# EAGLE design pi_zero_drone_controller_hat (EAGLE 8.5.2)

## Sheet 1 of 2
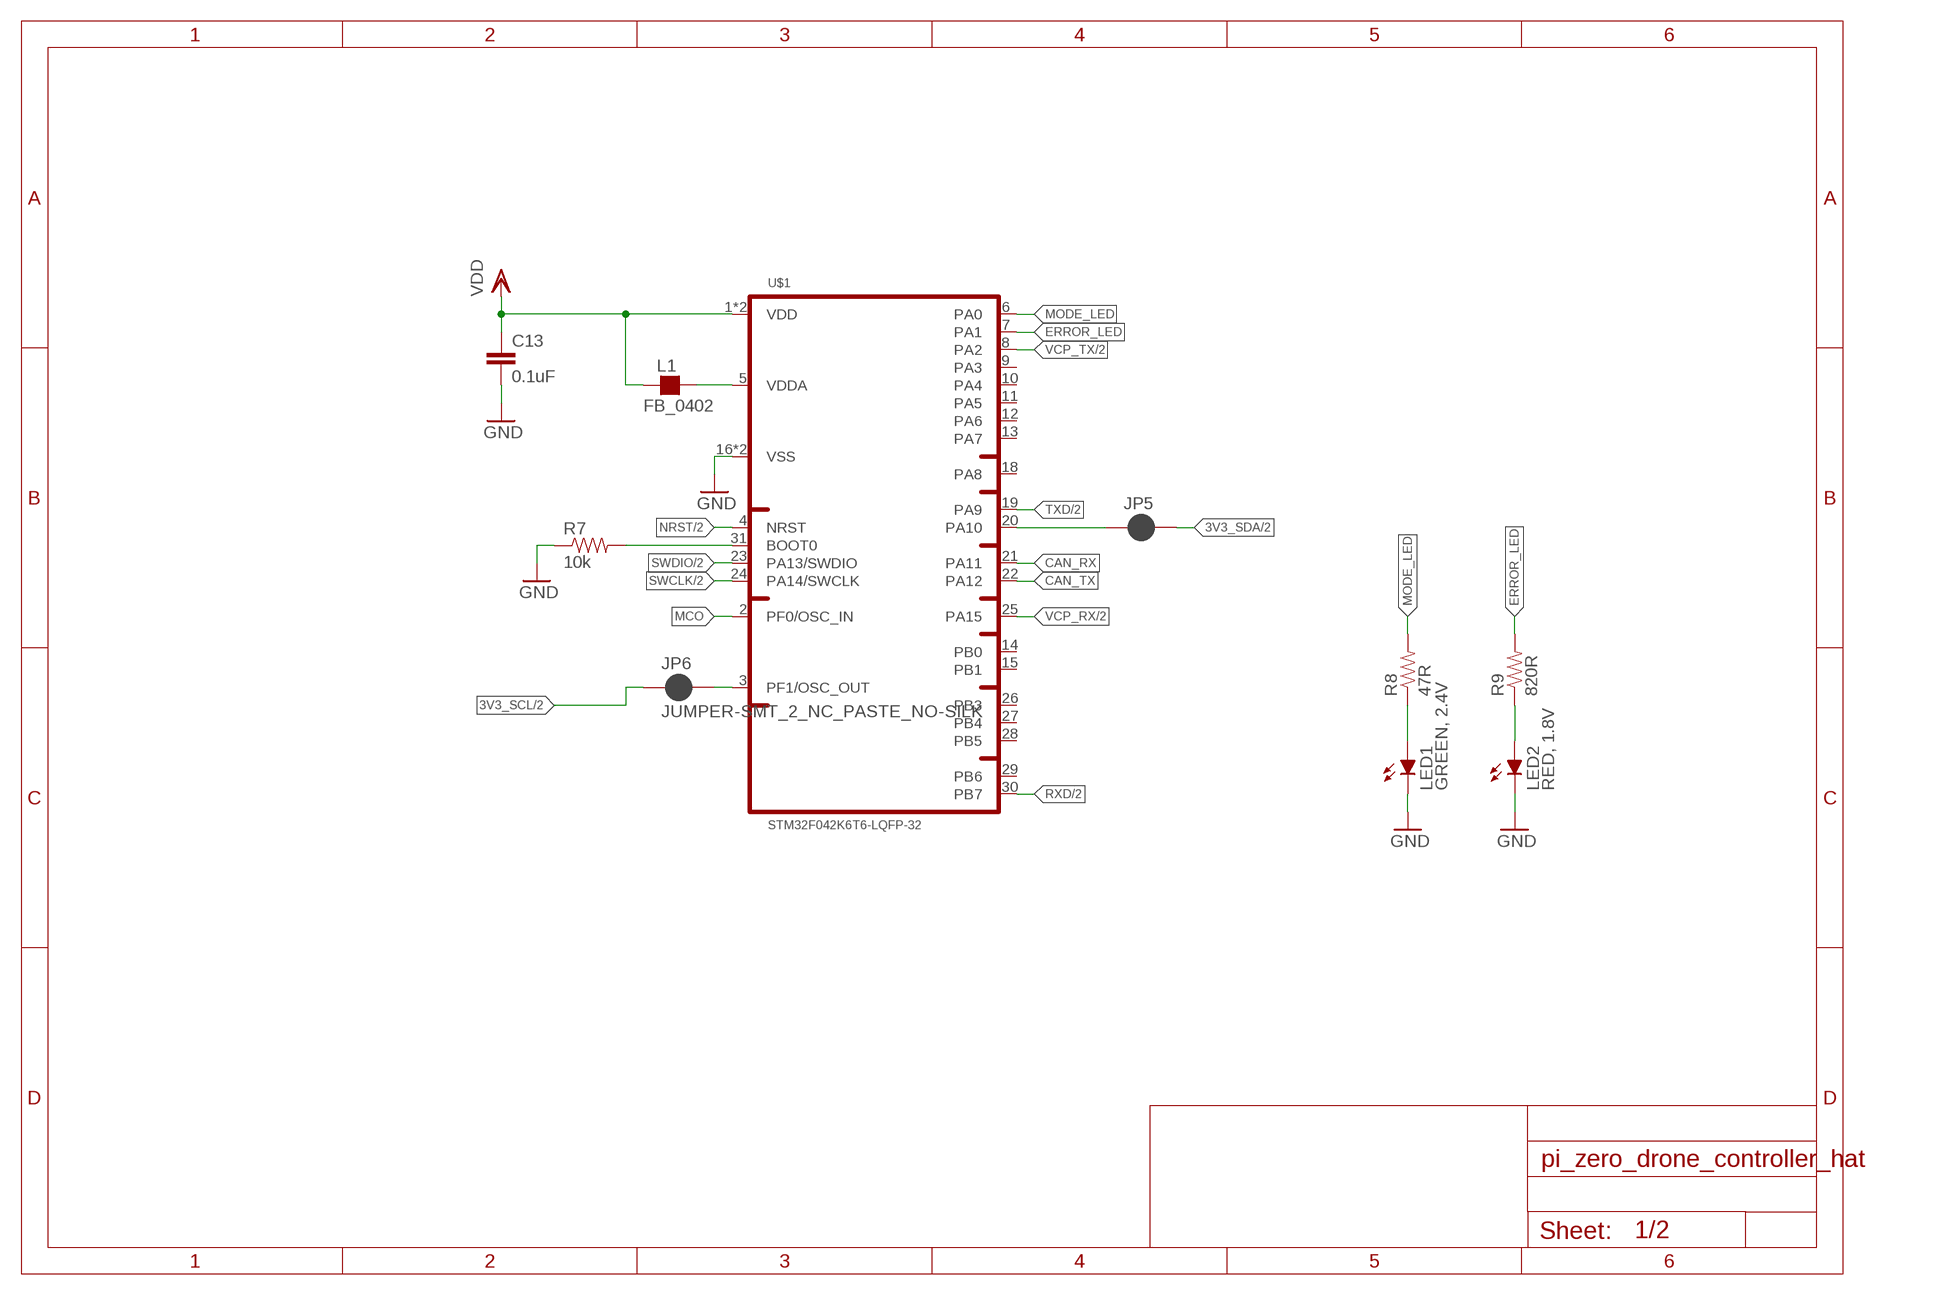
[diagram p0: schematic, sheet 1]

### Parts
C13  0.1uF  0.1UF-0402-16V-10%  [0402]
JP5  JUMPER-SMT_2_NC_PASTE_NO-SILK  [SMT-JUMPER_2_NC_PASTE_NO-SILK]
JP6  JUMPER-SMT_2_NC_PASTE_NO-SILK  [SMT-JUMPER_2_NC_PASTE_NO-SILK]
L1  FB_0402  [L0402]
LED1  GREEN, 2.4V  LEDCHIP-LED0603  [CHIP-LED0603]
LED2  RED, 1.8V  LEDCHIP-LED0603  [CHIP-LED0603]
R7  10k  SPARKFUN-RESISTORS_RESISTOR  [RES_0402]
R8  47R  SPARKFUN-RESISTORS_RESISTOR  [RES_0402]
R9  820R  SPARKFUN-RESISTORS_RESISTOR  [RES_0402]
U$1  STM32F042K6T6-LQFP-32  [LQFP-32]

### Nets
3V3_SCL: JP6.1 ; also sheet 2
3V3_SDA: JP5.2 ; also sheet 2
CAN_RX: U$1.21(PA11)
CAN_TX: U$1.22(PA12)
ERROR_LED: R9.2 U$1.7(PA1)
GND: C13.2 LED1.C LED2.C R7.1 U$1.16(VSS) U$1.32(VSS) ; also sheet 2
MCO: U$1.2(PF0/OSC_IN)
MODE_LED: R8.2 U$1.6(PA0)
N$7: R7.2 U$1.31(BOOT0)
N$9: L1.2 U$1.5(VDDA)
N$10: JP5.1 U$1.20(PA10)
N$12: JP6.2 U$1.3(PF1/OSC_OUT)
N$14: LED2.A R9.1
N$15: LED1.A R8.1
NRST: U$1.4(NRST) ; also sheet 2
RXD: U$1.30(PB7) ; also sheet 2
SWCLK: U$1.24(PA14/SWCLK) ; also sheet 2
SWDIO: U$1.23(PA13/SWDIO) ; also sheet 2
TXD: U$1.19(PA9) ; also sheet 2
VCP_RX: U$1.25(PA15) ; also sheet 2
VCP_TX: U$1.8(PA2) ; also sheet 2
VDD: C13.1 L1.1 U$1.1(VDD) U$1.17(VDD) ; also sheet 2
Unconnected: U$1.9(PA3) U$1.10(PA4) U$1.11(PA5) U$1.12(PA6) U$1.13(PA7) U$1.14(PB0) U$1.15(PB1) U$1.18(PA8) U$1.26(PB3) U$1.27(PB4) U$1.28(PB5) U$1.29(PB6)

## Sheet 2 of 2
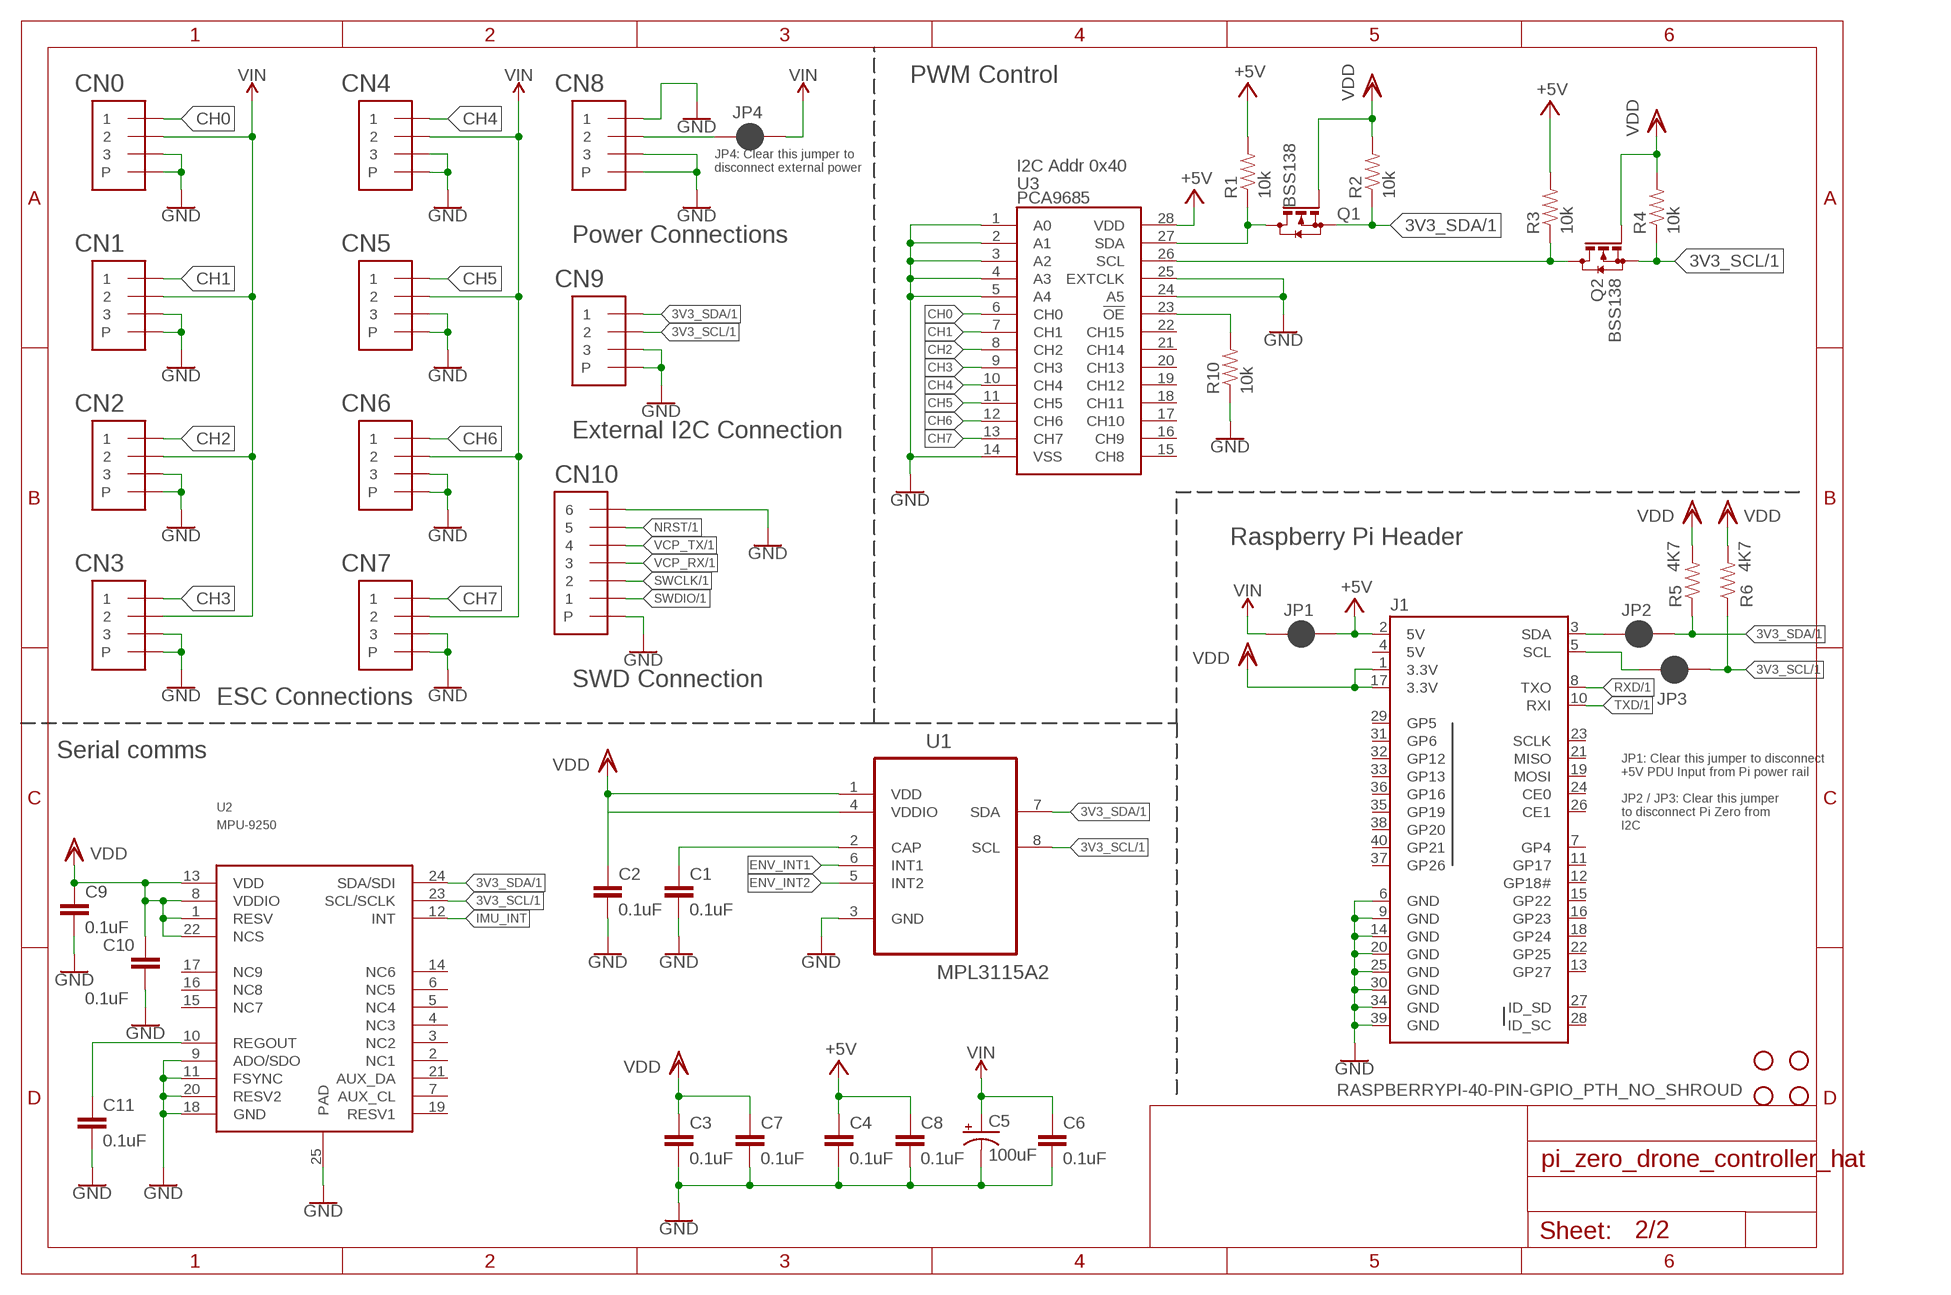
[diagram p1: schematic, sheet 2]

### Parts
C1  0.1uF  0.1UF-0402-16V-10%  [0402]
C2  0.1uF  0.1UF-0402-16V-10%  [0402]
C3  0.1uF  0.1UF-0402-16V-10%  [0402]
C4  0.1uF  0.1UF-0402-16V-10%  [0402]
C5  100uF  100UF-POLAR-25V-20%(ELEC)  [PANASONIC_D]
C6  0.1uF  0.1UF-0402-16V-10%  [0402]
C7  0.1uF  0.1UF-0402-16V-10%  [0402]
C8  0.1uF  0.1UF-0402-16V-10%  [0402]
C9  0.1uF  0.1UF-0402-16V-10%  [0402]
C10  0.1uF  0.1UF-0402-16V-10%  [0402]
C11  0.1uF  0.1UF-0402-16V-10%  [0402]
CN0  JST_SH_3  [JST_SH_3]
CN1  JST_SH_3  [JST_SH_3]
CN2  JST_SH_3  [JST_SH_3]
CN3  JST_SH_3  [JST_SH_3]
CN4  JST_SH_3  [JST_SH_3]
CN5  JST_SH_3  [JST_SH_3]
CN6  JST_SH_3  [JST_SH_3]
CN7  JST_SH_3  [JST_SH_3]
CN8  JST_SH_3  [JST_SH_3]
CN9  JST_SH_3  [JST_SH_3]
CN10  JST_SH_6  [JST_SH_6]
H1  STAND-OFF  [STAND-OFF]
H2  STAND-OFF  [STAND-OFF]
H3  STAND-OFF  [STAND-OFF]
H4  STAND-OFF  [STAND-OFF]
J1  RASPBERRYPI-40-PIN-GPIO_PTH_NO_SHROUD  [2X20]
JP1  JUMPER-SMT_2_NC_PASTE_NO-SILK  [SMT-JUMPER_2_NC_PASTE_NO-SILK]
JP2  JUMPER-SMT_2_NC_PASTE_NO-SILK  [SMT-JUMPER_2_NC_PASTE_NO-SILK]
JP3  JUMPER-SMT_2_NC_PASTE_NO-SILK  [SMT-JUMPER_2_NC_PASTE_NO-SILK]
JP4  JUMPER-SMT_2_NC_PASTE_NO-SILK  [SMT-JUMPER_2_NC_PASTE_NO-SILK]
Q1  BSS138  [SOT23]
Q2  BSS138  [SOT23]
R1  10k  SPARKFUN-RESISTORS_RESISTOR  [RES_0402]
R2  10k  SPARKFUN-RESISTORS_RESISTOR  [RES_0402]
R3  10k  SPARKFUN-RESISTORS_RESISTOR  [RES_0402]
R4  10k  SPARKFUN-RESISTORS_RESISTOR  [RES_0402]
R5  4K7  SPARKFUN-RESISTORS_RESISTOR  [RES_0402]
R6  4K7  SPARKFUN-RESISTORS_RESISTOR  [RES_0402]
R10  10k  SPARKFUN-RESISTORS_RESISTOR  [RES_0402]
U1  MPL3115A2  [DFN300X500X120-8N]
U2  MPU-9250  [LEAD-QFN24]
U3  PCA9685  [TSSOP-28_4MM]

### Nets
3V3_SCL: CN9.2 JP3.2 Q2.2(S) R4.1 R6.1 U1.8(SCL) U2.23(SCL/SCLK) ; also sheet 1
3V3_SDA: CN9.1 JP2.2 Q1.2(S) R2.1 R5.1 U1.7(SDA) U2.24(SDA/SDI) ; also sheet 1
+5V: C4.1 C8.1 J1.2(5V) JP1.2 R1.2 R3.2 U3.28(VDD)
CH0: CN0.1 U3.6(CH0)
CH1: CN1.1 U3.7(CH1)
CH2: CN2.1 U3.8(CH2)
CH3: CN3.1 U3.9(CH3)
CH4: CN4.1 U3.10(CH4)
CH5: CN5.1 U3.11(CH5)
CH6: CN6.1 U3.12(CH6)
CH7: CN7.1 U3.13(CH7)
ENV_INT1: U1.6(INT1)
ENV_INT2: U1.5(INT2)
GND: C1.2 C2.2 C3.2 C4.2 C5.- C6.2 C7.2 C8.2 C9.2 C10.2 C11.2 CN0.3 CN0.P$1(P) CN0.P$2(P) CN1.3 CN1.P$1(P) CN1.P$2(P) CN2.3 CN2.P$1(P) CN2.P$2(P) CN3.3 CN3.P$1(P) CN3.P$2(P) CN4.3 CN4.P$1(P) CN4.P$2(P) CN5.3 CN5.P$1(P) CN5.P$2(P) CN6.3 CN6.P$1(P) CN6.P$2(P) CN7.3 CN7.P$1(P) CN7.P$2(P) CN8.1 CN8.3 CN8.P$1(P) CN8.P$2(P) CN9.3 CN9.P$1(P) CN9.P$2(P) CN10.6 CN10.P$1(P) CN10.P$2(P) J1.6(GND) J1.9(GND) J1.14(GND) J1.20(GND) J1.25(GND) J1.30(GND) J1.34(GND) J1.39(GND) R10.1 U1.3(GND) U2.9(ADO/SDO) U2.11(FSYNC) U2.18(GND) U2.20(RESV2) U2.25(PAD) U3.1(A0) U3.2(A1) U3.3(A2) U3.4(A3) U3.5(A4) U3.14(VSS) U3.24(A5) U3.25(EXTCLK) ; also sheet 1
IMU_INT: U2.12(INT)
N$1: Q1.3(D) R1.1 U3.27(SDA)
N$2: Q2.3(D) R3.1 U3.26(SCL)
N$3: C11.1 U2.10(REGOUT)
N$4: J1.5(SCL) JP3.1
N$5: J1.3(SDA) JP2.1
N$6: C1.1 U1.2(CAP)
N$8: CN8.2 JP4.1
N$11: R10.2 U3.23(!OE)
NRST: CN10.5 ; also sheet 1
RXD: J1.8(TXO) ; also sheet 1
SWCLK: CN10.2 ; also sheet 1
SWDIO: CN10.1 ; also sheet 1
TXD: J1.10(RXI) ; also sheet 1
VCP_RX: CN10.3 ; also sheet 1
VCP_TX: CN10.4 ; also sheet 1
VDD: C2.1 C3.1 C7.1 C9.1 C10.1 J1.1(3.3V) J1.17(3.3V) Q1.1(G) Q2.1(G) R2.2 R4.2 R5.2 R6.2 U1.1(VDD) U1.4(VDDIO) U2.1(RESV) U2.8(VDDIO) U2.13(VDD) U2.22(NCS) ; also sheet 1
VIN: C5.+ C6.1 CN0.2 CN1.2 CN2.2 CN3.2 CN4.2 CN5.2 CN6.2 CN7.2 JP1.1 JP4.2
Unconnected: J1.7(GP4) J1.11(GP17) J1.12(GP18#) J1.13(GP27) J1.15(GP22) J1.16(GP23) J1.18(GP24) J1.19(MOSI) J1.21(MISO) J1.22(GP25) J1.23(SCLK) J1.24(CE0) J1.26(CE1) J1.27(ID_SD) J1.28(ID_SC) J1.29(GP5) J1.31(GP6) J1.32(GP12) J1.33(GP13) J1.35(GP19) J1.36(GP16) J1.37(GP26) J1.38(GP20) J1.40(GP21) U2.2(NC1) U2.3(NC2) U2.4(NC3) U2.5(NC4) U2.6(NC5) U2.7(AUX_CL) U2.14(NC6) U2.15(NC7) U2.16(NC8) U2.17(NC9) U2.19(RESV1) U2.21(AUX_DA) U3.15(CH8) U3.16(CH9) U3.17(CH10) U3.18(CH11) U3.19(CH12) U3.20(CH13) U3.21(CH14) U3.22(CH15)

### Notes on the sheet
- PWM Control
- JP4: Clear this jumper to 
  disconnect external power
- I2C Addr 0x40
- Power Connections
- External I2C Connection
- Raspberry Pi Header
- SWD Connection
- ESC Connections
- Serial comms
- JP1: Clear this jumper to disconnect 
  +5V PDU Input from Pi power rail
  
  JP2 / JP3: Clear this jumper
  to disconnect Pi Zero from
  I2C

## Power pins joined to a net without a drawn wire
5V: J1.4(5V)

## Library data of the parts
C1-C4 C6-C11 C13 = SparkFun-Capacitors:0.1UF: 0.1µF ceramic capacitors A capacitor is a passive two-terminal electrical component used to store electrical energy temporarily in an electric field.; PROD_ID: CAP-12416
C5 = SparkFun-Capacitors:100UF-POLAR: 100µF polarized capacitors A capacitor is a passive two-terminal electrical component used to store electrical energy temporarily in an electric field.; PROD_ID: CAP-12547
CN0 CN1-CN9 = asg_motor_driver_copy:JST_SH_3
CN10 = asg_motor_driver_copy:JST_SH_6
H1-H4 = SparkFun-Hardware:STAND-OFF: Stand Off Drill holes for mechanically mounting via screws, standoffs, etc. Note: Use the keepout ring to avoid running the screw head into surrounding components. Variant Overviews STAND-OFF - Mechanical footprint for a #4 phillips button head screw. STAND-OFF-TIGHT - Mechanical footprint for a #4 phillips button head screw, Example SparkFun Products Screw - Phillips Head (1/4", 4-40, 10 pack) <https://www.sparkfun.com/products/10453> (PRT-10453) Screw - Phillips Head (1/2", 4-40, 10 pack) <https://www.sparkfun.com/products/10452> (PRT-10452) Screw - Phillips Head (3/4", 4-40, 10 pack) <https://www.sparkfun.com/products/10451> (PRT-10451) Screw - Phillips Head (1", 4-40, 10 pack) <https://www.sparkfun.com/products/10450> (PRT-10450)
J1 = SparkFun-Connectors:RASPBERRYPI-40-PIN-GPIO: Raspberry Pi GPIO Header 2x20 pin connector, as found on B, B+, A+ models. Both shrouded PTH and SMT versions available. SparkFun Products: GPIO Shrouded Header <https://www.sparkfun.com/products/13054>- PTH SparkFun Pi Wedge (Preassembled) <https://www.sparkfun.com/products/13717>
JP1-JP6 = SparkFun-Jumpers:JUMPER-SMT_2_NC_PASTE: Normally closed solder jumper This jumper has an aperture in the stencil to allow solder paste to bridge the split in the wire so it's normally closed (NC). Wick off the solder to open the connection. Reapply solder to reclose the connection.
L1 = asg_motor_driver_copy:FB_: FERRITE BEAD
LED1 LED2 = asg_motor_driver_copy:LED: LED Various Types
Q1 Q2 = asg_motor_driver_copy:BSS138: N-CHANNEL MOS FET
R1-R10 = asg_motor_driver_copy:SPARKFUN-RESISTORS_RESISTOR: Resistor Basic schematic elements and footprints for 0603, 1206, and PTH resistors.
U1 = MPL3115A2:MPL3115A2: PRESSURE SENSOR, 20-110KPA, 8LGA; MPN: MPL3115A2; OC_FARNELL: 2009084; OC_NEWARK: 48T4344; PACKAGE: 8LGA; SUPPLIER: FREESCALE SEMICONDUCTOR
U2 = invensense:MPU-9250
U3 = SparkFun-IC-Special-Function:PCA9685: 16-channel 12-bit PWM I2C interface Internal Oscillator 40Hz to 1kHz Can be totem pole or open collector 2.3V to 5.5V SparkFun Products SparkFun Block for Intel® Edison - PWM <https://www.sparkfun.com/products/13042> (DEV-13042) PROTO: IC-12240 PROD_ID: IC-12271; PROD_ID: IC-12271
U$1 = STM32F042K6T6:STM32F042K6T6

## Board
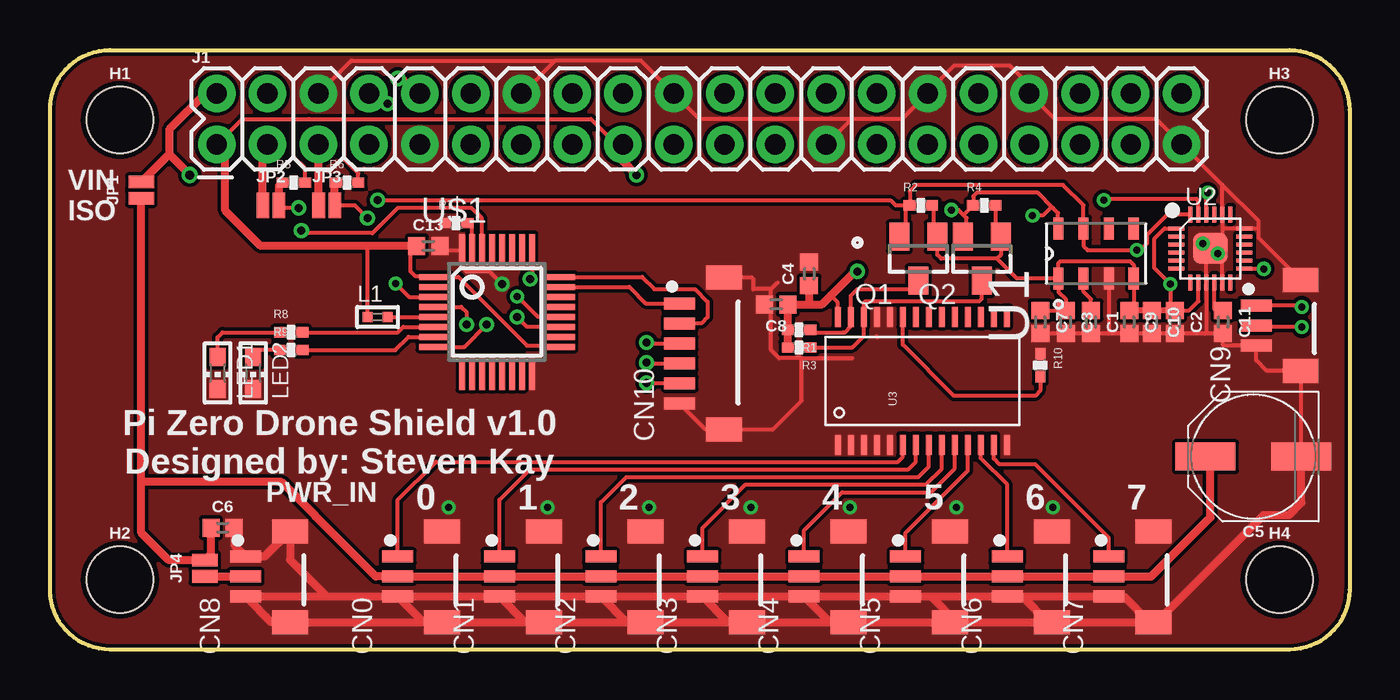
[diagram p2: board, top side]
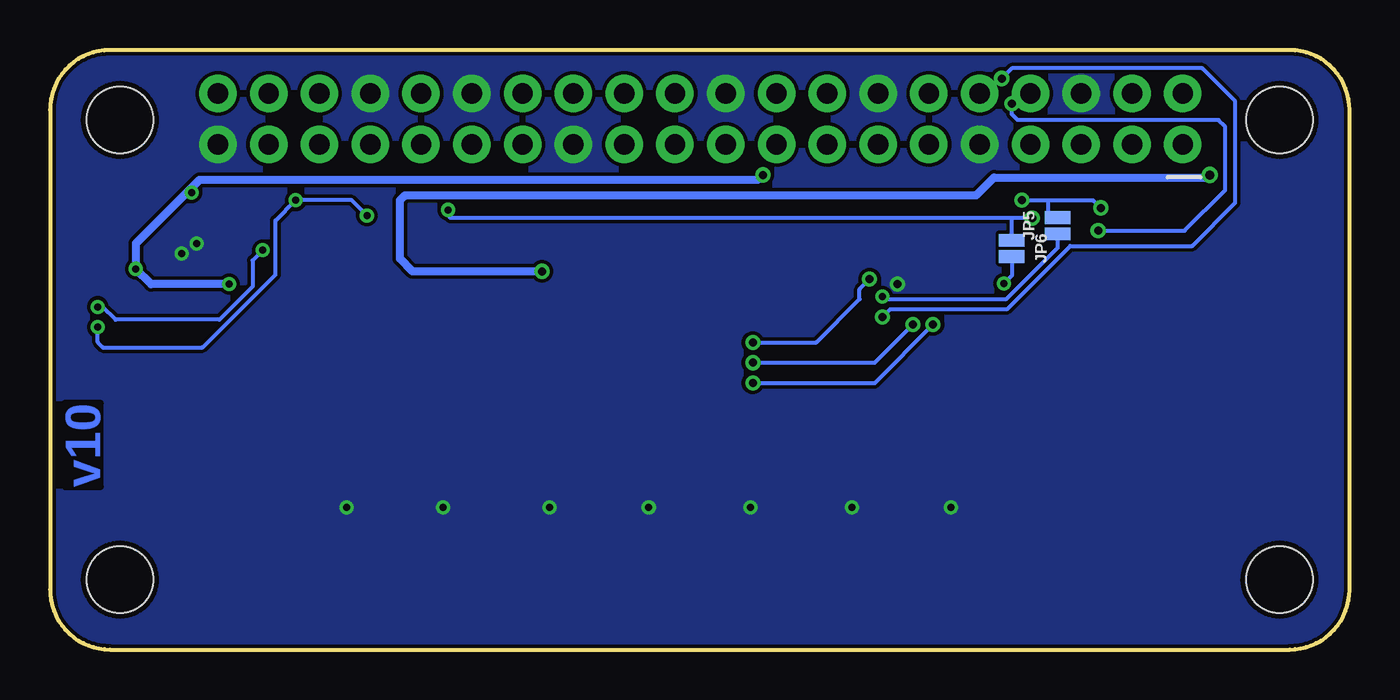
[diagram p3: board, bottom side, seen from below]

Size 65 x 30 mm. Coordinates in mm from the lower left corner, seen from the top.
Outline: 62,0 3,0 arc-90 0,3 0,27 arc-90 3,30 62,30 arc-90 65,27 65,3 arc-90 62,0
Copper layers (1*16): Top 0.035mm / dielectric 1.5mm / Bottom 0.035mm
Design rules "SparkFun-2-layer-TIGHT": minimum track width 7mil, minimum drill 15mil, track to track 7mil, track to pad 7mil, pad to pad 7mil, via to via 7mil, smd to smd 7mil, copper to edge 7mil, drill to drill 7mil, minimum pad ring 7mil, minimum via ring 7mil, stop-mask expansion 4mil, vias tented up to drill 25mil, thermal gap 10mil

### Footprints (pad centres in the part's own frame; a part is rotated, then mirrored left to right if it is on the bottom)
0402 = smd 0.85 x 0.9: 1 -0.58,0; 2 0.58,0
PANASONIC_D = smd 3 x 1.4: + 2.4,0; - -2.4,0
JST_SH_3 = smd 0.6 x 1.55: 1 0.46,1.27; 2 -0.54,1.27; 3 -1.54,1.27 | smd 1.2 x 1.8: P$1 -2.824,-0.955; P$2 1.728,-0.955
JST_SH_6 = smd 0.6 x 1.55: 1 5,0; 2 4,0; 3 3,0; 4 2,0; 5 1,0; 6 0,0 | smd 1.2 x 1.8: P$1 -1.3,-2.225; P$2 6.3,-2.225
STAND-OFF = hole 3.302: 0,0
2X20 = drill 1.016 pad 1.88: 1 0,0; 2 0,2.54; 3 2.54,0; 4 2.54,2.54; 5 5.08,0; 6 5.08,2.54; 7 7.62,0; 8 7.62,2.54; 9 10.16,0; 10 10.16,2.54; 11 12.7,0; 12 12.7,2.54; 13 15.24,0; 14 15.24,2.54; 15 17.78,0; 16 17.78,2.54; 17 20.32,0; 18 20.32,2.54; 19 22.86,0; 20 22.86,2.54; 21 25.4,0; 22 25.4,2.54; 23 27.94,0; 24 27.94,2.54; 25 30.48,0; 26 30.48,2.54; 27 33.02,0; 28 33.02,2.54; 29 35.56,0; 30 35.56,2.54; 31 38.1,0; 32 38.1,2.54; 33 40.64,0; 34 40.64,2.54; 35 43.18,0; 36 43.18,2.54; 37 45.72,0; 38 45.72,2.54; 39 48.26,0; 40 48.26,2.54
SMT-JUMPER_2_NC_PASTE_NO-SILK = smd 0.635 x 1.27: 1 -0.406,0; 2 0.406,0
L0402 = smd 0.5 x 0.5: 1 -0.508,0; 2 0.508,0
CHIP-LED0603 = smd 0.8 x 0.9: A 0,-0.794; C 0,0.794
SOT23 = smd 1 x 1.4: 1 -0.95,-1.1; 2 0.95,-1.1; 3 0,1.1
RES_0402 = smd 0.61 x 0.508: 1 -0.559,0; 2 0.559,0
DFN300X500X120-8N = smd 1.092 x 0.508: 1 -1.245,1.88; 2 -1.245,0.635; 3 -1.245,-0.635; 4 -1.245,-1.88; 5 1.245,-1.88; 6 1.245,-0.635; 7 1.245,0.635; 8 1.245,1.88
LEAD-QFN24 = smd 0.8 x 0.2: 1 -1.7,1; 2 -1.7,0.6; 3 -1.7,0.2; 4 -1.7,-0.2; 5 -1.7,-0.6; 6 -1.7,-1; 13 1.7,-1; 14 1.7,-0.6; 15 1.7,-0.2; 16 1.7,0.2; 17 1.7,0.6; 18 1.7,1 | smd 0.2 x 0.8: 7 -1,-1.7; 8 -0.6,-1.7; 9 -0.2,-1.7; 10 0.2,-1.7; 11 0.6,-1.7; 12 1,-1.7; 19 1,1.7; 20 0.6,1.7; 21 0.2,1.7; 22 -0.2,1.7; 23 -0.6,1.7; 24 -1,1.7 | smd 1.7 x 1.54: 25 0,0
TSSOP-28_4MM = smd 1 x 0.3: 1 -3.2,4.225; 2 -3.2,3.575; 3 -3.2,2.925; 4 -3.2,2.275; 5 -3.2,1.625; 6 -3.2,0.975; 7 -3.2,0.325; 8 -3.2,-0.325; 9 -3.2,-0.975; 10 -3.2,-1.625; 11 -3.2,-2.275; 12 -3.2,-2.925; 13 -3.2,-3.575; 14 -3.2,-4.225; 15 3.2,-4.225; 16 3.2,-3.575; 17 3.2,-2.925; 18 3.2,-2.275; 19 3.2,-1.625; 20 3.2,-0.975; 21 3.2,-0.325; 22 3.2,0.325; 23 3.2,0.975; 24 3.2,1.625; 25 3.2,2.275; 26 3.2,2.925; 27 3.2,3.575; 28 3.2,4.225
LQFP-32 = smd 0.3 x 1.6: 1 -1.75,-3.1; 2 -1.25,-3.1; 3 -0.75,-3.1; 4 -0.25,-3.1; 5 0.25,-3.1; 6 0.75,-3.1; 7 1.25,-3.1; 8 1.75,-3.1; 17 1.75,3.1; 18 1.25,3.1; 19 0.75,3.1; 20 0.25,3.1; 21 -0.25,3.1; 22 -0.75,3.1; 23 -1.25,3.1; 24 -1.75,3.1 | smd 1.6 x 0.3: 9 3.1,-1.75; 10 3.1,-1.25; 11 3.1,-0.75; 12 3.1,-0.25; 13 3.1,0.25; 14 3.1,0.75; 15 3.1,1.25; 16 3.1,1.75; 25 -3.1,1.75; 26 -3.1,1.25; 27 -3.1,0.75; 28 -3.1,0.25; 29 -3.1,-0.25; 30 -3.1,-0.75; 31 -3.1,-1.25; 32 -3.1,-1.75

### Placement (x,y rotation side)
C1  52.07,16.38 270 top
C2  56.26,16.38 270 top
C3  50.8,16.38 270 top
C4  37.97,18.8 90 top
C5  60.2,9.65 180 top
C6  8.64,6.1 0 top
C7  49.53,16.38 270 top
C8  36.32,17.27 180 top
C9  53.98,16.38 270 top
C10  55.12,16.38 270 top
C11  58.67,16.38 270 top
C13  18.92,20.19 0 top
CN0  18.67,4.19 90 top
CN1  23.75,4.19 90 top
CN2  28.83,4.19 90 top
CN3  33.91,4.19 90 top
CN4  38.99,4.19 90 top
CN5  44.07,4.19 90 top
CN6  49.15,4.19 90 top
CN7  54.23,4.19 90 top
CN8  11.05,4.19 90 top
CN9  61.59,16.76 90 top
CN10  31.5,12.32 90 top
H1  3.5,26.5 0 top
H2  3.5,3.5 0 top
H3  61.5,26.5 0 top
H4  61.5,3.5 0 top
J1  8.34,25.28 0 top
JP1  4.57,22.99 90 top
JP2  11.05,22.23 0 top
JP3  13.84,22.23 0 top
JP4  7.75,4.06 90 top
JP5  14.61,21.21 90 bottom
JP6  16.89,20.07 270 bottom
L1  16.38,16.64 0 top
LED1  8.38,13.84 180 top
LED2  10.16,13.84 180 top
Q1  43.43,19.56 180 top
Q2  46.61,19.56 180 top
R1  37.47,16 180 top
R2  43.56,22.23 0 top
R3  37.47,15.11 180 top
R4  46.74,22.23 0 top
R5  12.19,23.37 0 top
R6  14.86,23.37 0 top
R7  20.32,21.34 0 top
R8  12.06,15.88 0 top
R9  12.06,14.99 0 top
R10  49.53,14.22 270 top
U1  52.32,19.81 90 top
U2  58.04,20.07 0 top
U3  43.63,13.45 90 top
U$1  22.35,16.89 270 top

### Tracks (layer width: path | path; a pad name or v marks a point on that pad's centre or on a via)
3V3_SCL  (via drill 0.35, 0.4)
  Top 0.203: v62.61,16.13 60.42,16.13 CN9.2 | U1.8 50.42,21.08 50.42,21.84 50.16,22.1 | 50.16,22.1 50.04,22.1 49.66,21.72 v49.15,21.72 | U2.23 57.44,22.44 57.34,22.54 52.77,22.54 v52.7,22.48 | 50.16,22.1 49.4,22.86 46.35,22.86 46.18,22.68 R4.1 45.72,21.77 45.72,21.72 | 45.72,21.72 45.85,21.59 45.85,20.85 Q2.2 | 45.72,21.72 45.44,22 v45.09,22 | JP3.2 15.24,22.23 v15.87,21.6 v15.88,21.6
  Top 0.406: JP3.2 14.25,23.32 R6.1
  Bottom 0.203: v15.88,21.6 16.89,21.6 | 16.89,21.6 44.96,21.6 45.09,21.72 v45.09,22 | v62.61,16.13 62.61,15.37 62.36,15.11 57.37,15.11 53.72,18.76 53.72,20.95 53.72,21.46 v52.7,22.48 49.91,22.48 v49.15,21.72 | JP6.1 16.89,21.6
3V3_SDA  (via drill 0.35, 0.4)
  Top 0.203: U2.24 55.9,21.77 54.86,20.73 54.86,20.32 54.61,20.07 54.44,20.07 v54.36,19.98 51.9,19.98 51.69,20.19 U1.7 | 51.69,20.7 U1.7 | v62.61,17.14 62.53,17.22 CN9.1 | v12.45,22.1 11.58,22.1 JP2.2 | U1.7 51.69,22.23 50.67,23.24 43.31,23.24 43,22.94 R2.1 | R2.1 42.8,22.02 42.8,20.97 Q1.2 | R2.1 42.29,22.23 42.04,22.48 v16.38,22.48
  Top 0.406: 11.46,23.16 JP2.2 11.46,23.19 R5.1
  Bottom 0.203: v54.36,19.98 54.86,19.47 54.86,18.16 56.52,16.51 61.72,16.51 62.36,17.14 v62.61,17.14 | v16.38,22.48 15.11,22.48 | 15.11,22.48 12.83,22.48 v12.45,22.1 | JP5.2 15.09,21.61 | 15.09,21.61 15.11,21.59 15.12,21.59 | 15.11,22.48 15.09,22.45 15.09,21.61
+5V  (via drill 0.4, 0.45)
  Top 0.203: U3.28 39.41,17.36 39.05,17.72
  Top 0.406: J1.2 7.75,27.82 5.97,26.04 5.97,24.79 | 5.97,24.79 JP1.2 | v6.99,23.75 6.99,23.77 5.97,24.79 | R3.2 R1.2 C8.1 37.97,17.27 | v40.39,18.92 40.26,18.92 39.05,17.72 38.61,17.27 37.97,17.27 | C4.1 37.97,17.27
  Bottom 0.406: v40.39,18.92 46.86,18.92 47.5,19.56 47.5,22.48 47.24,22.73 18.67,22.73 17.78,23.62 7.11,23.62 v6.99,23.75
CH0
  Top 0.203: U3.6 42.66,9.64 42.42,9.4 19.3,9.4 17.4,7.49 CN0.1
CH1
  Top 0.203: U3.7 43.31,9.4 42.93,9.02 24,9.02 22.48,7.49 CN1.1
CH2
  Top 0.203: U3.8 43.96,9.16 43.43,8.64 28.83,8.64 27.56,7.37 CN2.1
CH3
  Top 0.203: CN3.1 32.64,6.1 34.8,8.26 43.81,8.26 44.61,9.05 U3.9
CH4
  Top 0.203: CN4.1 37.72,5.97 39.62,7.87 44.07,7.87 45.26,9.06 U3.10
CH5
  Top 0.203: CN5.1 42.8,5.84 45.91,8.95 U3.11
CH6
  Top 0.203: CN6.1 47.88,8.26 46.56,9.57 U3.12
CH7
  Top 0.203: CN7.1 52.96,5.59 49.28,9.27 47.5,9.27 47.21,9.56 U3.13
ERROR_LED
  Top 0.203: R9.2 17.27,14.99 17.93,15.64 U$1.7
GND  (via drill 0.35, 0.4)
  Top 0.203: 58.64,20.95 U2.20 58.64,23.24 | 58.64,20.95 58.64,20.67 U2.25 | U2.25 57.84,19.87 U2.9 57.84,15.86 57.78,15.8 | U2.11 58.64,19.47 U2.25 | J1.39 55.34,26.54 50.26,26.54 J1.34 48.98,28.24 48.01,29.21 45.21,29.21 43.9,27.9 J1.30 42.62,26.54 40.08,26.54 | 40.08,26.54 J1.25 | 40.08,26.54 32.48,26.54 J1.20 29.56,29.46 25.27,29.46 | 25.27,29.46 23.63,27.82 J1.14 | 18.5,25.48 J1.9 | 56.6,24.85 J1.39 | J1.6 15.06,29.46 25.27,29.46 | 37.59,14.58 36.47,14.58 36.07,14.99 36.07,18.03 | 58.64,23.24 J1.39 | 60.45,21.08 59.76,21.08 U2.18 58.75,21.07 58.64,20.95 | 60.45,21.08 60.45,21.43 58.64,23.24 | C5.- 62.6,13.89 CN9.P$1 60.86,13.94 60.33,14.48 CN9.3 58.69,15.22 58.67,15.24 C11.2 57.78,15.8 | CN9.P$2 60.45,20.59 60.45,21.08 | CN10.6 32.8,11.02 CN10.P$1 36.16,11.02 37.59,12.45 37.59,14.58 | 19.76,20.45 C13.2 19.7,19.99 U$1.32 20.6,19.15 20.84,18.91 21.98,18.91 v22.61,18.29 | 36.07,18.03 36.39,18.36 | 36.07,18.03 35.18,18.03 35.18,18.54 35.1,18.62 CN10.P$2 | 37.59,14.58 40.14,14.58 | 41.36,15.66 41.4,15.62 | 57.78,15.8 52.96,15.8 | 52.96,15.8 C7.2 49.35,15.62 | U1.3 52.96,15.8
  Top 0.406: 13.84,2.65 CN8.3 11.06,1.37 CN8.P$1 CN0.P$1 | 13.84,2.65 CN0.3 | CN0.3 CN1.3 | CN1.3 CN2.3 | CN2.3 CN3.3 | CN3.3 CN4.3 | CN4.3 CN5.3 | CN5.3 CN6.3 | CN6.3 CN7.3 53.71,2.65 54.99,1.37 | 9.66,4.77 CN8.1 | CN8.1 10.74,4.65 CN8.P$2 12,4.49 13.84,2.65 | CN0.P$1 23.76,1.37 | CN2.P$1 CN1.P$1 23.76,1.37 | CN2.P$1 33.92,1.37 | CN4.P$1 CN3.P$1 33.92,1.37 | CN4.P$1 CN5.P$1 45.34,1.37 | 45.34,1.37 49.91,1.37 | 49.91,1.37 CN6.P$1 54.99,1.37 | 54.99,1.37 CN7.P$1 55.34,1.37 60.71,6.73 61.98,6.73 62.6,7.35 C5.- | C6.2 9.22,5.21 CN8.1 | CN6.3 48.63,2.65 49.91,1.37 | CN5.3 44.05,2.65 45.34,1.37 | CN4.3 39,1.37 CN4.P$1 | CN3.3 33.92,1.37 | CN2.3 28.84,1.37 CN2.P$1 | CN1.3 23.76,1.37 | CN0.3 18.68,1.37 CN0.P$1
  other vias: 57.66,20.32 58.42,19.81 19.94,7.11 24.89,7.11 29.97,7.11 35.05,7.11 45.34,7.11 50.16,7.11 40.01,7.11
  pour Top (no thermals): -0.13,30.61 -0.13,0.89 1.78,-1.02 63.88,-1.02 65.79,0.89 65.79,28.96 63.5,31.24 0.51,31.24
  pour Bottom (no thermals): 2.03,32.26 -1.4,28.83 -1.4,1.27 1.27,-1.4 62.87,-1.4 66.17,1.91 66.29,1.91 66.29,28.83 63.5,31.62 62.87,32.26
MODE_LED
  Top 0.203: U$1.6 17.66,16.14 17.4,15.88 R8.2
N$1
  Top 0.203: R1.1 38.16,15.87 39.67,15.87 39.68,15.88 39.75,15.88 40.06,16.18 U3.27 40.06,17.71 40.39,18.03 43.05,18.03 43.43,18.41 Q1.3
N$2
  Top 0.203: R3.1 40.13,15.11 40.71,15.69 U3.26 40.71,17.34 40.8,17.43 46.48,17.43 46.61,17.56 Q2.3
N$3
  Top 0.203: U2.10 58.24,17.02 58.62,17.02 C11.1
N$4
  Top 0.406: JP3.1 13.44,25.26 J1.5
N$5
  Top 0.406: J1.3 10.9,25.26 10.64,25.01 JP2.1
N$6
  Top 0.203: C1.1 52.07,17.53 51.69,17.91 U1.2
N$7
  Top 0.203: U$1.31 21.1,21.11 R7.2
N$8
  Top 0.406: JP4.1 CN8.2
N$9
  Top 0.203: L1.2 U$1.5
N$10  (via drill 0.35)
  Top 0.203: U$1.20 24.41,16.64 23.37,17.68 v23.37,17.66
  Bottom 0.203: JP5.1 14.61,20.1 17.16,17.54 23.25,17.54 v23.37,17.66
N$11
  Top 0.203: R10.2 49.53,12.95 49.28,12.7 48.51,12.7 48.39,12.7 45.21,12.7 42.66,15.25 U3.23
N$12  (via drill 0.35)
  Top 0.203: v17.29,18.31 17.95,17.64 U$1.3
  Bottom 0.203: v17.29,18.31 16.89,18.7 JP6.2
N$14
  Top 0.203: R9.1 10.51,14.99 LED2.A
N$15
  Top 0.203: LED1.A 8.38,15.62 8.64,15.88 R8.1
NRST  (via drill 0.4)
  Top 0.203: v29.84,13.34 31.48,13.34 CN10.5 | U$1.4 20.57,17.14 20.83,16.89 v20.83,16.26
  Bottom 0.203: v20.83,16.26 23.75,13.34 v29.84,13.34
RXD  (via drill 0.4)
  Top 0.203: v16.89,27.3 16.48,27.3 J1.8 | v12.57,20.95 12.69,20.84 16.14,20.84 17.4,22.1 21.08,22.1 21.6,21.58 U$1.30
  Bottom 0.203: v16.89,27.3 16.89,26.8 16.59,26.5 6.56,26.5 6.22,26.16 6.22,22.99 8.26,20.95 v12.57,20.95
SWCLK
  Top 0.203: U$1.24 29.62,18.64 30.23,18.03 32.26,18.03 32.89,17.4 32.89,16.64 32.58,16.32 CN10.2
SWDIO
  Top 0.203: U$1.23 28.98,18.14 29.8,17.32 CN10.1
TXD  (via drill 0.4)
  Top 0.203: v17.4,28.57 17.75,28.57 J1.10 | U$1.19 23.86,16.14 v23.36,16.64
  Bottom 0.203: v17.4,28.57 16.89,29.08 7.37,29.08 5.71,27.43 5.71,22.35 7.87,20.19 13.97,20.19 17.14,17.02 22.98,17.02 v23.36,16.64
VCP_RX  (via drill 0.4)
  Top 0.203: v29.84,15.37 29.89,15.32 CN10.3 | U$1.25 24.1,18.64 v24,18.54
  Bottom 0.203: v29.84,15.37 26.67,15.37 24.51,17.53 24.51,18.03 v24,18.54
VCP_TX  (via drill 0.4)
  Top 0.203: v29.84,14.35 29.88,14.32 CN10.4 | U$1.8 20.73,15.14 v21.84,16.26
  Bottom 0.203: v21.84,16.26 23.75,14.35 v29.84,14.35
VDD  (via drill 0.35, 0.4)
  Top 0.203: v60.71,19.05 59.76,19.05 U2.13 | J1.1 9.6,26.54 12.19,26.54 | J1.17 28.31,25.28 27.05,26.54 14.73,26.54 | 12.19,26.54 12.95,26.54 | 12.95,26.54 14.73,26.54 | 54.2,18.82 U1.4 | v56.04,18.28 55.24,19.08 55.24,20.57 55.75,21.08 55.77,21.07 U2.1 | Q2.1 47.56,19.75 47.37,19.56 | 47.37,19.56 44.58,19.56 44.38,19.75 Q1.1 44.2,20.85 44.2,22.15 R2.2 | R5.2 12.75,24.08 12.19,24.64 | 12.19,24.64 12.2,24.65 | 12.95,26.54 | R6.2 15.42,23.82 14.73,24.51 14.73,26.54 | L1.1 15.88,20.19 | 18.03,20.19 18.03,18.92 18.29,18.67 19.22,18.67 U$1.1 20.43,18.64 23.86,15.21 25.38,15.21 U$1.17 | 55.88,18.12 v56.04,18.28 | U1.1 50.44,17.88 50.8,17.53 C3.1 C7.1 | U1.1 48.36,18.57 47.37,19.56 | U2.8 57.44,17.43 56.97,16.96 C2.1 56.04,17.18 v56.04,18.28 | U1.4 54.2,16.99 54.23,16.96 | U1.4 54.2,19.24 54.01,19.43 50.55,19.43 50.44,19.33 U1.1 | U2.22 57.84,22.79 v57.91,22.86 | R4.2 47.3,20.92 | 12.19,24.64 12.19,26.54 | C9.1 C10.1
  Top 0.305: C2.1 C10.1 54.23,16.96 C9.1
  Top 0.406: v29.34,23.75 28.66,24.43 J1.17 | C13.1 18.03,20.19 15.88,20.19 10.54,20.19 8.76,21.97 8.76,24.86 J1.1 | 47.3,20.92 Q2.1
  Bottom 0.203: 60.71,18.92 v60.71,19.05
  Bottom 0.406: v56.04,18.28 59.94,18.28 v60.71,19.05 60.71,20.32 57.91,23.11 | v29.34,23.75 29.59,23.5 57.53,23.5 57.91,23.11 | 57.91,23.11 v57.91,22.86
VIN
  Top 0.406: C5.+ 58.04,9.41 58.04,6.6 55.09,3.65 CN7.2 CN6.2 CN5.2 CN4.2 CN3.2 CN2.2 CN1.2 CN0.2 16.29,3.65 13.29,6.65 13.29,6.68 11.58,8.38 4.57,8.38 | 4.57,8.38 4.57,5.84 5.94,4.47 JP4.2 8.06,4.78 C6.1 | 4.57,8.38 JP1.1

### Text on the board
Bottom: v10
tPlace: VIN / ISO | Pi Zero Drone Shield v1.0 / Designed by: Steven Kay | PWR_IN | 0 | 1 | 2 | 3 | 4 | 5 | 6 | 7
Measures: typ. | typ. | Dimensions given in mm